# EAGLE design Tiny-G-ZA (EAGLE 6.4)
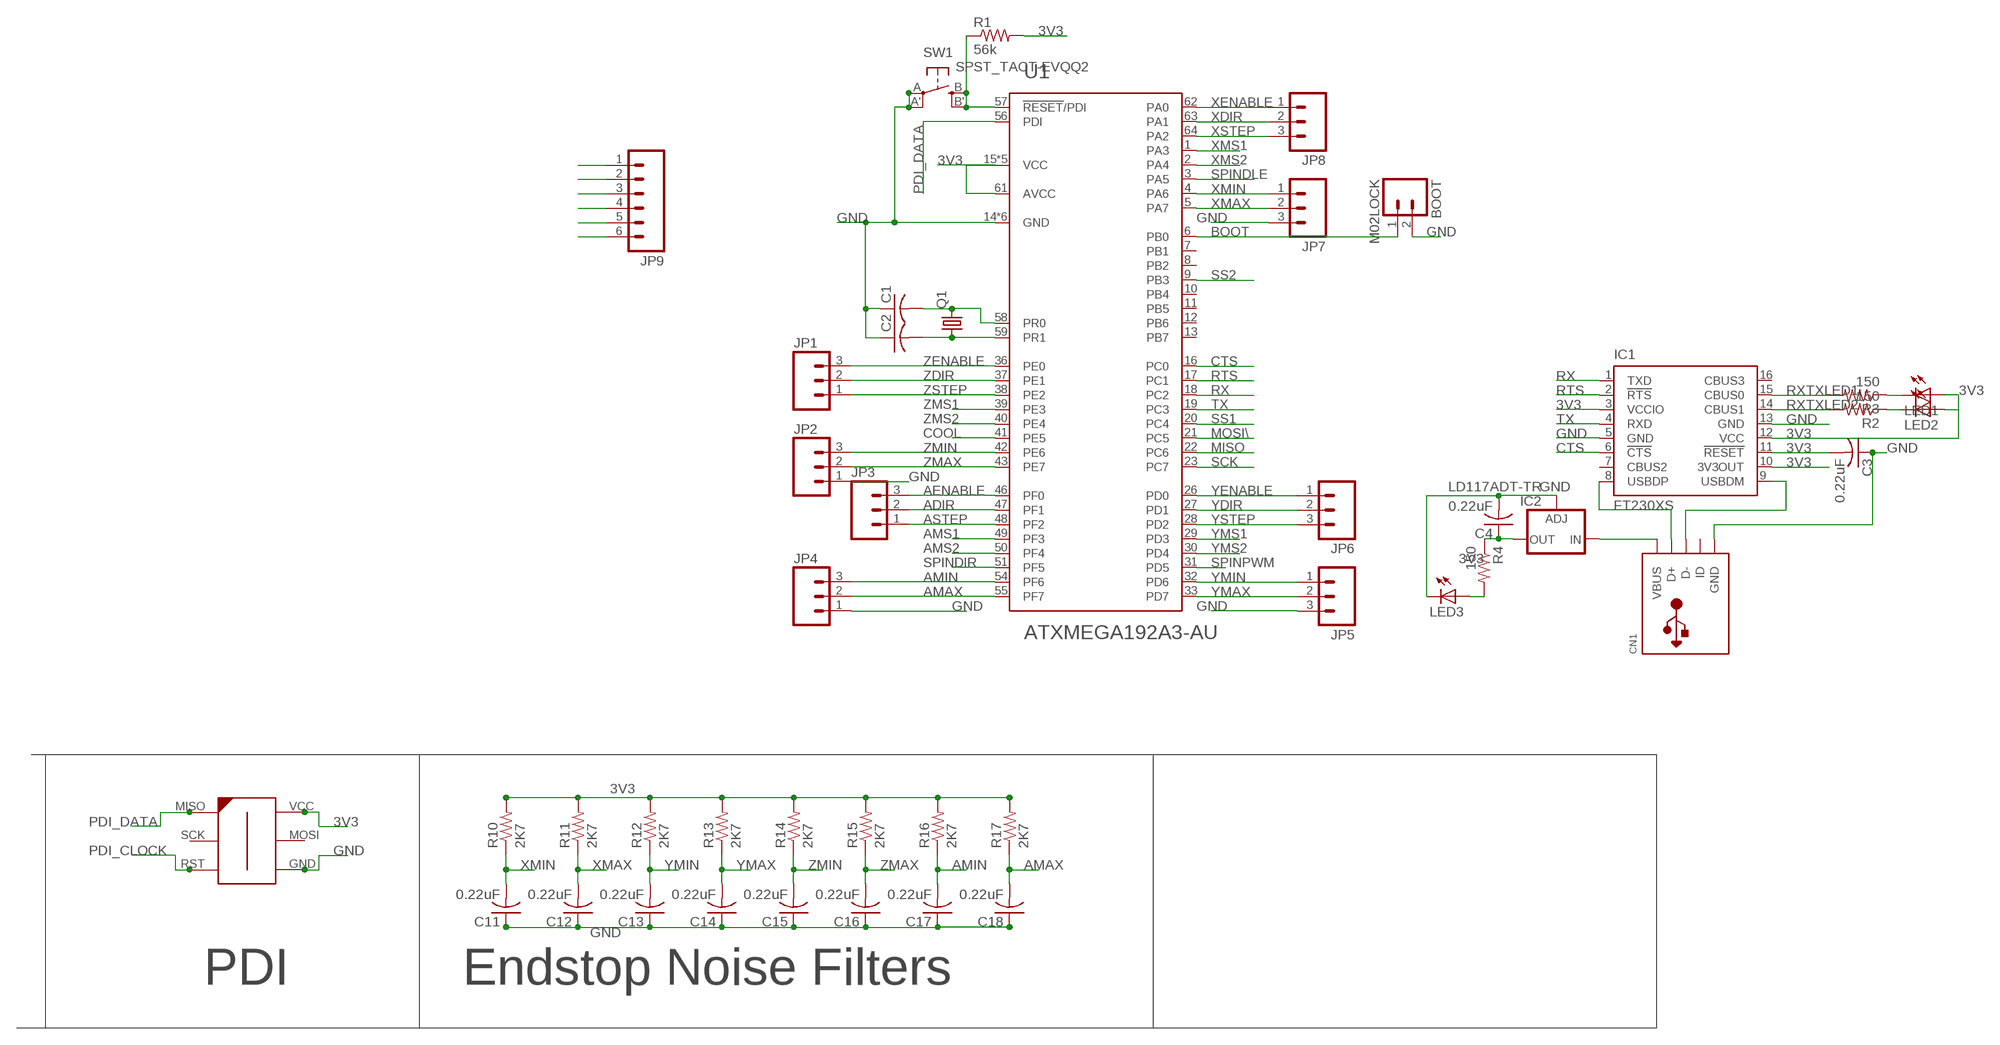
[diagram p0: schematic, sheet 1]

## Parts
BOOT  M02LOCK  [1X02_LOCK]
C1  C-USC1206K  [C1206K]
C2  C-USC1206K  [C1206K]
C3  0.22uF  C-USC1206K  [C1206K]
C4  0.22uF  C-USC1206K  [C1206K]
C11  0.22uF  C-USC1206K  [C1206K]
C12  0.22uF  C-USC1206K  [C1206K]
C13  0.22uF  C-USC1206K  [C1206K]
C14  0.22uF  C-USC1206K  [C1206K]
C15  0.22uF  C-USC1206K  [C1206K]
C16  0.22uF  C-USC1206K  [C1206K]
C17  0.22uF  C-USC1206K  [C1206K]
C18  0.22uF  C-USC1206K  [C1206K]
CN1  USBMINIB  [USB-MINIB]
IC1  FT230XS  [SSOP16]
IC2  LD117ADT-TR  [DPACK]
JP1  M03LONGPADS  [1X03_LONGPADS]
JP2  M03LONGPADS  [1X03_LONGPADS]
JP3  M03LONGPADS  [1X03_LONGPADS]
JP4  M03LONGPADS  [1X03_LONGPADS]
JP5  M03LONGPADS  [1X03_LONGPADS]
JP6  M03LONGPADS  [1X03_LONGPADS]
JP7  M03LONGPADS  [1X03_LONGPADS]
JP8  M03LONGPADS  [1X03_LONGPADS]
JP9  M06LONGPADS  [1X06_LONGPADS]
LED1  LEDSMT1206  [1206]
LED2  LEDSMT1206  [1206]
LED3  LEDSMT1206  [1206]
Q1  CRYSTALHC49UP  [HC49UP]
R1  56k  R-US_M1206  [M1206]
R2  150  R-US_M1206  [M1206]
R3  150  R-US_M1206  [M1206]
R4  150  R-US_M1206  [M1206]
R10  2K7  R-US_M1206  [M1206]
R11  2K7  R-US_M1206  [M1206]
R12  2K7  R-US_M1206  [M1206]
R13  2K7  R-US_M1206  [M1206]
R14  2K7  R-US_M1206  [M1206]
R15  2K7  R-US_M1206  [M1206]
R16  2K7  R-US_M1206  [M1206]
R17  2K7  R-US_M1206  [M1206]
SW1  SPST_TACT-EVQQ2  [EVQ-Q2]
U1  ATXMEGA192A3-AU  [TQFP-64A-64]
U$1  AVR-ISP-6-EDGE  [6PAD_ISP]

## Nets
3V3: C3.2 C4.1 IC1.3(VCCIO) IC1.10(3V3OUT) IC1.11(!RESET) IC1.12(VCC) IC2.4(OUT) JP9.1 LED1.A LED2.A R1.2 R4.1 R10.2 R11.2 R12.2 R13.2 R14.2 R15.2 R16.2 R17.2 U1.15(VCC) U1.25(VCC) U1.35(VCC) U1.45(VCC) U1.53(VCC) U1.61(AVCC) U$1.VCC
5V: CN1.VBUS IC2.3(IN)
ADIR: JP3.2 U1.47(PF1)
AENABLE: JP3.3 U1.46(PF0)
AMAX: C18.2 JP4.2 R17.1 U1.55(PF7)
AMIN: C17.2 JP4.3 R16.1 U1.54(PF6)
AMS1: U1.49(PF3)
AMS2: U1.50(PF4)
ASTEP: JP3.1 U1.48(PF2)
BOOT: BOOT.1 U1.6(PB0)
COOL: JP9.6 U1.41(PE5)
CTS: IC1.6(!CTS) U1.16(PC0)
GND: BOOT.2 C1.1 C2.1 C3.1 C4.2 C11.1 C12.1 C13.1 C14.1 C15.1 C16.1 C17.1 C18.1 CN1.GND IC1.5(GND) IC1.13(GND) IC2.1(ADJ) JP2.1 JP4.1 JP5.3 JP7.3 JP9.2 LED3.C SW1.A'(P1) SW1.A(P) U1.14(GND) U1.24(GND) U1.34(GND) U1.44(GND) U1.52(GND) U1.60(GND) U$1.GND
MISO: U1.22(PC6)
MOSI\: U1.21(PC5)
N$1: CN1.D+ IC1.8(USBDP)
N$2: CN1.D- IC1.9(USBDM)
N$3: LED3.A R4.2
N$4: LED2.C R2.1
N$5: LED1.C R3.1
PDI_CLOCK: R1.1 SW1.B'(S1) SW1.B(S) U1.57(!RESET!/PDI) U$1.RST
PDI_DATA: U1.56(PDI) U$1.MISO
PR0: C1.2 Q1.2 U1.58(PR0)
PR1: C2.2 Q1.1 U1.59(PR1)
RTS: IC1.2(!RTS) U1.17(PC1)
RX: IC1.1(TXD) U1.18(PC2)
RXTXLED1: IC1.15(CBUS0) R3.2
RXTXLED2: IC1.14(CBUS1) R2.2
SCK: U1.23(PC7)
SPINDIR: JP9.5 U1.51(PF5)
SPINDLE: JP9.3 U1.3(PA5)
SPINPWM: JP9.4 U1.31(PD5)
SS1: U1.20(PC4)
SS2: U1.9(PB3)
TX: IC1.4(RXD) U1.19(PC3)
XDIR: JP8.2 U1.63(PA1)
XENABLE: JP8.1 U1.62(PA0)
XMAX: C12.2 JP7.2 R11.1 U1.5(PA7)
XMIN: C11.2 JP7.1 R10.1 U1.4(PA6)
XMS1: U1.1(PA3)
XMS2: U1.2(PA4)
XSTEP: JP8.3 U1.64(PA2)
YDIR: JP6.2 U1.27(PD1)
YENABLE: JP6.1 U1.26(PD0)
YMAX: C14.2 JP5.2 R13.1 U1.33(PD7)
YMIN: C13.2 JP5.1 R12.1 U1.32(PD6)
YMS1: U1.29(PD3)
YMS2: U1.30(PD4)
YSTEP: JP6.3 U1.28(PD2)
ZDIR: JP1.2 U1.37(PE1)
ZENABLE: JP1.3 U1.36(PE0)
ZMAX: C16.2 JP2.2 R15.1 U1.43(PE7)
ZMIN: C15.2 JP2.3 R14.1 U1.42(PE6)
ZMS1: U1.39(PE3)
ZMS2: U1.40(PE4)
ZSTEP: JP1.1 U1.38(PE2)
Unconnected: CN1.ID IC1.7(CBUS2) IC1.16(CBUS3) U1.7(PB1) U1.8(PB2) U1.10(PB4) U1.11(PB5) U1.12(PB6) U1.13(PB7) U$1.MOSI U$1.SCK

## Notes on the sheet
- PDI | Endstop Noise Filters

## Library data of the parts
BOOT = SparkFun-Connectors:M02: Standard 2-pin 0.1" header. Use with - straight break away headers ( PRT-00116) - right angle break away headers (PRT-00553) - swiss pins (PRT-00743) - machine pins (PRT-00117) - female headers (PRT-00115) Molex polarized connector foot print use with: PRT-08233 with associated crimp pins and housings. 2.54_SCREWTERM for use with PRT-10571. 3.5mm Screw Terminal footprints for PRT-08084 5mm Screw Terminal footprints for use with PRT-08432
C1-C4 C11-C18 = adafruit:C-US: CAPACITOR, American symbol
CN1 = adafruit:USB: USB Connectors USBMINIB - Surface Mount Female Mini-B USB Connector 4UConnector: 06564 By microbuilder.eu Thru-hole RA Female Mini-B USB Connector 4UConnector: 18732 By ladyada.net
IC1 = ftdichip:FT230X: USB to BASIC UART IC Auto generated by make-symbol-device-package-bsdl.ulp Rev. 43 Source: Data sheet <http://www.ftdichip.com/Support/Documents/DataSheets/ICs/DS_FT230X.pdf>
IC2 = v-reg:LD117A?*: Low drop fixed and adjustable positive voltage regulators 1 A Source: http://www.st.com/stonline/products/literature/ds/7194/ld1117axx.pdf
JP1-JP8 = SparkFun-Connectors:M03: Header 3 Standard 3-pin 0.1" header. Use with straight break away headers (SKU : PRT-00116), right angle break away headers (PRT-00553), swiss pins (PRT-00743), machine pins (PRT-00117), and female headers (PRT-00115). Molex polarized connector foot print use with SKU : PRT-08232 with associated crimp pins and housings.
JP9 = SparkFun-Connectors:M06: Header 6 Standard 6-pin 0.1" header. Use with straight break away headers (SKU : PRT-00116), right angle break away headers (PRT-00553), swiss pins (PRT-00743), machine pins (PRT-00117), and female headers (PRT-00115). Molex polarized connector foot print use with SKU : PRT-08094 with associated crimp pins and housings. NOTES ON THE VARIANTS LOCK and LOCK_LONGPADS... This footprint was designed to help hold the alignment of a through-hole component (i.e. 6-pin header) while soldering it into place. You may notice that each hole has been shifted either up or down by 0.005 of an inch from it's more standard position (which is a perfectly straight line). This slight alteration caused the pins (the squares in the middle) to touch the edges of the holes. Because they are alternating, it causes a "brace" to hold the component in place. 0.005 has proven to be the perfect amount of "off-center" position when using our standard breakaway headers. Although looks a little odd when you look at the bare footprint, once you have a header in there, the alteration is very hard to notice. Also,if you push a header all the way into place, it is covered up entirely on the bottom side. This idea of altering the position of holes to aid alignment will be further integrated into the Sparkfun Library for other footprints. It can help hold any component with 3 or more connection pins.
LED1-LED3 = led:LED: LED OSRAM: - CHIPLED LG R971, LG N971, LY N971, LG Q971, LY Q971, LO R971, LY R971 LH N974, LH R974 LS Q976, LO Q976, LY Q976 LO Q996 - Hyper CHIPLED LW Q18S LB Q993, LB Q99A, LB R99A - SideLED LS A670, LO A670, LY A670, LG A670, LP A670 LB A673, LV A673, LT A673, LW A673 LH A674 LY A675 LS A676, LA A676, LO A676, LY A676, LW A676 LS A679, LY A679, LG A679 - Hyper Micro SIDELED® LS Y876, LA Y876, LO Y876, LY Y876 LT Y87S - SmartLED LW L88C, LW L88S LB L89C, LB L89S, LG L890 LS L89K, LO L89K, LY L89K LS L896, LA L896, LO L896, LY L896 - TOPLED LS T670, LO T670, LY T670, LG T670, LP T670 LSG T670, LSP T670, LSY T670, LOP T670, LYG T670 LG T671, LOG T671, LSG T671 LB T673, LV T673, LT T673, LW T673 LH T674 LS T676, LA T676, LO T676, LY T676, LB T676, LH T676, LSB T676, LW T676 LB T67C, LV T67C, LT T67C, LS T67K, LO T67K, LY T67K, LW E67C LS E67B, LA E67B, LO E67B, LY E67B, LB E67C, LV E67C, LT E67C LW T67C LS T679, LY T679, LG T679 LS T770, LO T770, LY T770, LG T770, LP T770 LB T773, LV T773, LT T773, LW T773 LH T774 LS E675, LA E675, LY E675, LS T675 LS T776, LA T776, LO T776, LY T776, LB T776 LHGB T686 LT T68C, LB T68C - Hyper Mini TOPLED® LB M676 - Mini TOPLED Santana® LG M470 LS M47K, LO M47K, LY M47K Source: http://www.osram.convergy.de LUXEON: - LUMILED® LXK2-PW12-R00, LXK2-PW12-S00, LXK2-PW14-U00, LXK2-PW14-V00 LXK2-PM12-R00, LXK2-PM12-S00, LXK2-PM14-U00 LXK2-PE12-Q00, LXK2-PE12-R00, LXK2-PE12-S00, LXK2-PE14-T00, LXK2-PE14-U00 LXK2-PB12-K00, LXK2-PB12-L00, LXK2-PB12-M00, LXK2-PB14-N00, LXK2-PB14-P00, LXK2-PB14-Q00 LXK2-PR12-L00, LXK2-PR12-M00, LXK2-PR14-Q00, LXK2-PR14-R00 LXK2-PD12-Q00, LXK2-PD12-R00, LXK2-PD12-S00 LXK2-PH12-R00, LXK2-PH12-S00 LXK2-PL12-P00, LXK2-PL12-Q00, LXK2-PL12-R00 Source: www.luxeon.com KINGBRIGHT: KA-3528ASYC Source: www.kingbright.com
Q1 = crystal:CRYSTAL: CRYSTAL; OC_FARNELL: unknown; OC_NEWARK: unknown
R1-R4 R10-R17 = adafruit:R-US_: RESISTOR, American symbol
SW1 = adafruit:SPST_TACT: SMT 6mm switch, EVQQ2 series http://www.ladyada.net/library/eagle
U1 = atmega-atxmega:ATXMEGA192A3: 8/16-bit XMEGA A3 Microcontroller Features High-performance, Low-power 8/16-bit Atmel® AVR® XMEGATM Microcontroller Non-volatile Program and Data Memories – 64 KB - 256 KB of In-System Self-Programmable Flash – 4 KB - 8 KB Boot Code Section with Independent Lock Bits – 2 KB - 4 KB EEPROM – 4 KB - 16 KB Internal SRAM Peripheral Features – Four-channel DMA Controller with support for external requests – Eight-channel Event System – Seven 16-bit Timer/Counters Four Timer/Counters with 4 Output Compare or Input Capture channels Three Timer/Counters with 2 Output Compare or Input Capture channels High Resolution Extensions on all Timer/Counters Advanced Waveform Extension on one Timer/Counter – Seven USARTs IrDA Extension on 1 USART – AES and DES Crypto Engine – Two Two-wire Interfaces with dual address match (I2C and SMBus compatible) – Three SPI (Serial Peripheral Interfaces) – 16-bit Real Time Counter with Separate Oscillator – Two Eight-channel, 12-bit, 2 Msps Analog to Digital Converters – One Two-channel, 12-bit, 1 Msps Digital to Analog Converter – Four Analog Comparators with Window compare function – External Interrupts on all General Purpose I/O pins – Programmable Watchdog Timer with Separate On-chip Ultra Low Power Oscillator Special Microcontroller Features – Power-on Reset and Programmable Brown-out Detection – Internal and External Clock Options with PLL – Programmable Multi-level Interrupt Controller – Sleep Modes: Idle, Power-down, Standby, Power-save, Extended Standby – Advanced Programming, Test and Debugging Interfaces JTAG (IEEE 1149.1 Compliant) Interface for test, debug and programming PDI (Program and Debug Interface) for programming, test and debugging I/O and Packages – 50 Programmable I/O Lines – 64-lead TQFP – 64-pad QFN Operating Voltage – 1.6 – 3.6V Speed performance – 0 – 12 MHz @ 1.6 – 3.6V – 0 – 32 MHz @ 2.7 – 3.6V
U$1 = atmega-atxmega:AVR-ISP-6-EDGE: 6 pin edge connector for ISP with ATMEL MCUs. Developed by Craig Moates (craig at moates dot net). Library by David Blundell (blundar at gmail dot com). Often, even a 6 pin header is really inconvenient for board layout and/or production. This SMD-only header is our de-facto standard for using an edge connector for programming with the help of a 6pin/10pin to edge card adapter.

## Board
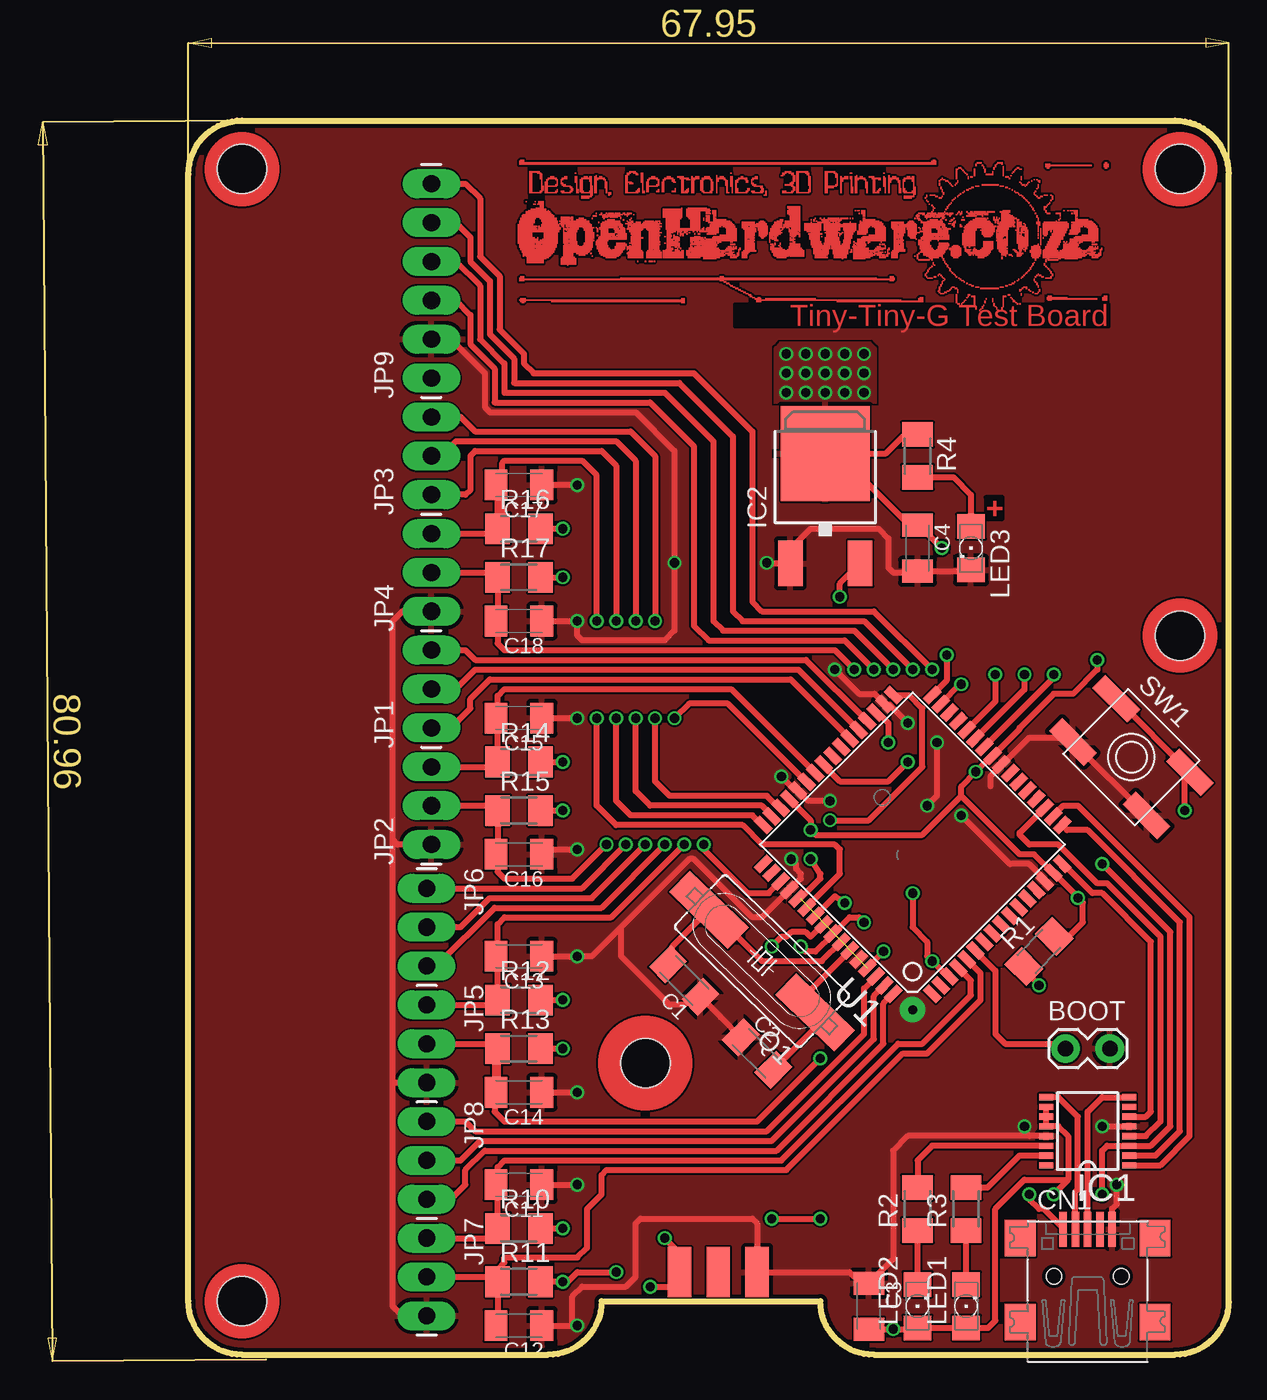
[diagram p1: board, top side]
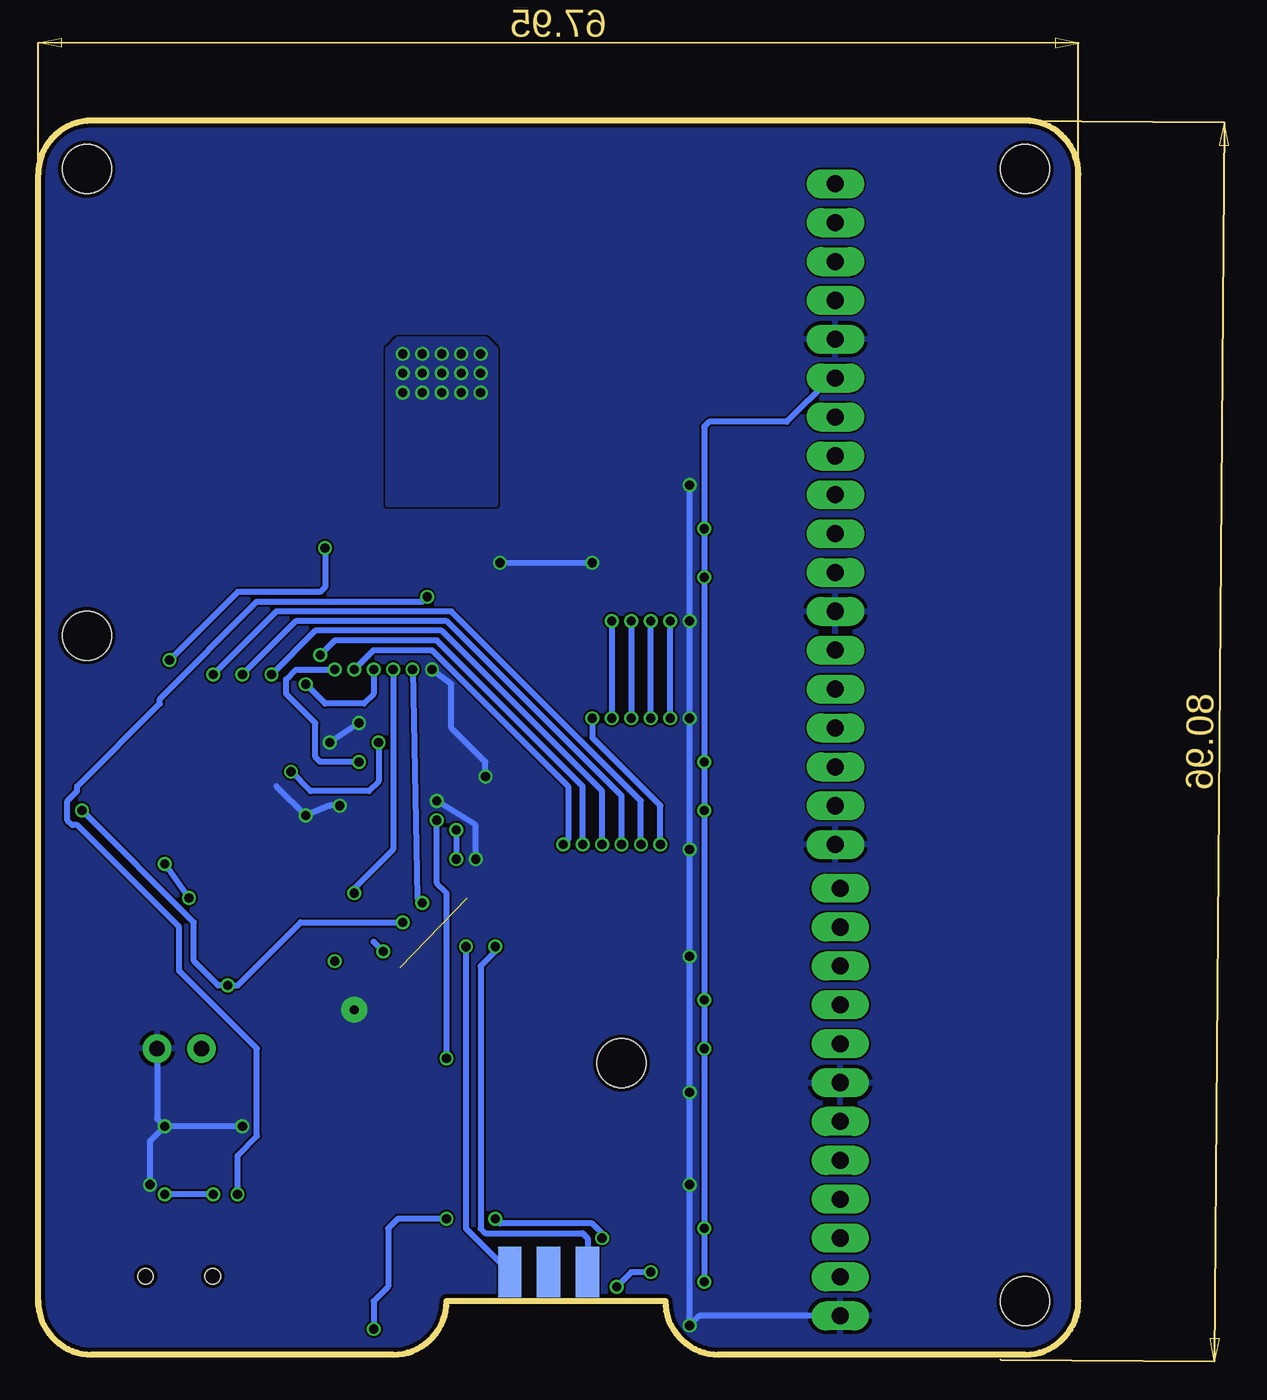
[diagram p2: board, bottom side, seen from below]

Size 67.94 x 80.65 mm. Coordinates in mm from the lower left corner, seen from the top.
Outline: 0,77.14 0,3.49 arc90 3.49,0 23.49,0 arc90 26.99,3.49 41.27,3.49 arc90 44.77,0 64.45,0 arc90 67.94,3.49
Outline: 0,77.15 arc-90 3.49,80.64
Outline: 3.17,80.64 64.44,80.64
Outline: 67.94,3.17 67.94,77.15 arc90 64.45,80.64
Copper layers (1*16): Top 0.035mm / dielectric 1.5mm / Bottom 0.035mm
Design rules "dirt_cheap_dirty_boards.v1": minimum track width 5mil, minimum drill 12mil, track to track 5mil, track to pad 5mil, pad to pad 5mil, via to via 5mil, smd to smd 0mil, copper to edge 10mil, drill to drill 10mil, minimum pad ring 10mil, minimum via ring 6mil, stop-mask expansion 2mil, vias tented up to drill 25mil, thermal gap 10mil
Holes 3.2 mm at 3.49,3.49 3.49,77.47 64.77,77.47 29.84,19.05 64.77,46.99

### Footprints (pad centres in the part's own frame; a part is rotated, then mirrored left to right if it is on the bottom)
1X02_LOCK = drill 1.016 pad 1.88: 1 -0.178,0; 2 2.718,0
C1206K = smd 1.5 x 2: 1 -1.5,0; 2 1.5,0
USB-MINIB = smd 0.5 x 2.308: D+ 0,4.064; D- -0.8,4.064; GND 1.6,4.064; ID 0.8,4.064; VBUS -1.6,4.064 | smd 2 x 2.4: GND1 -4.4,-2; GND2 -4.4,3.5; GND3 4.4,3.5; GND4 4.4,-2 | hole 1: -2.2,1; 2.2,1
SSOP16 = smd 0.914 x 0.406: 1 -2.718,2.223; 2 -2.718,1.587; 3 -2.718,0.953; 4 -2.718,0.318; 5 -2.718,-0.318; 6 -2.718,-0.953; 7 -2.718,-1.587; 8 -2.718,-2.223; 9 2.718,-2.223; 10 2.718,-1.587; 11 2.718,-0.953; 12 2.718,-0.318; 13 2.718,0.318; 14 2.718,0.953; 15 2.718,1.587; 16 2.718,2.223
DPACK = smd 1.6 x 3: 1 -2.28,-4.8; 3 2.28,-4.8 | smd 5.8 x 6.2: 4 0,2.38
1X03_LONGPADS = drill 1.118 pad 1.88 long: 1 0,0; 2 2.54,0; 3 5.08,0
1X06_LONGPADS = drill 1.118 pad 1.88 long: 1 0,0; 2 2.54,0; 3 5.08,0; 4 7.62,0; 5 10.16,0; 6 12.7,0
1206 = smd 1.6 x 1.803: A -1.422,0; C 1.422,0
HC49UP = smd 5.334 x 1.93: 1 -4.826,0; 2 4.826,0
M1206 = smd 1.6 x 2: 1 -1.4,0; 2 1.4,0
EVQ-Q2 = smd 3.2 x 1.2: A -3.4,-2; A' 3.4,-2; B -3.4,2; B' 3.4,2
TQFP-64A-64 = smd 1.194 x 0.559: 1 -7.8,6; 2 -7.8,5.2; 3 -7.8,4.4; 4 -7.8,3.6; 5 -7.8,2.8; 6 -7.8,2; 7 -7.8,1.2; 8 -7.8,0.4; 9 -7.8,-0.4; 10 -7.8,-1.2; 11 -7.8,-2; 12 -7.8,-2.8; 13 -7.8,-3.6; 14 -7.8,-4.4; 15 -7.8,-5.2; 16 -7.8,-6; 33 7.8,-6; 34 7.8,-5.2; 35 7.8,-4.4; 36 7.8,-3.6; 37 7.8,-2.8; 38 7.8,-2; 39 7.8,-1.2; 40 7.8,-0.4; 41 7.8,0.4; 42 7.8,1.2; 43 7.8,2; 44 7.8,2.8; 45 7.8,3.6; 46 7.8,4.4; 47 7.8,5.2; 48 7.8,6 | smd 0.559 x 1.194: 17 -6,-7.8; 18 -5.2,-7.8; 19 -4.4,-7.8; 20 -3.6,-7.8; 21 -2.8,-7.8; 22 -2,-7.8; 23 -1.2,-7.8; 24 -0.4,-7.8; 25 0.4,-7.8; 26 1.2,-7.8; 27 2,-7.8; 28 2.8,-7.8; 29 3.6,-7.8; 30 4.4,-7.8; 31 5.2,-7.8; 32 6,-7.8; 49 6,7.8; 50 5.2,7.8; 51 4.4,7.8; 52 3.6,7.8; 53 2.8,7.8; 54 2,7.8; 55 1.2,7.8; 56 0.4,7.8; 57 -0.4,7.8; 58 -1.2,7.8; 59 -2,7.8; 60 -2.8,7.8; 61 -3.6,7.8; 62 -4.4,7.8; 63 -5.2,7.8; 64 -6,7.8
6PAD_ISP = smd 1.524 x 3.302 bottom: GND 2.54,0; MOSI 0,0; VCC -2.54,0 | smd 1.524 x 3.302: MISO -2.54,0; RST 2.54,0; SCK 0,0

### Placement (x,y rotation side)
BOOT  57.47,20 0 top
C1  32.38,24.45 135 top
C2  37.15,19.69 315 top
C3  44.45,3.17 270 top
C4  47.62,52.7 270 top
C11  21.59,11.11 180 top
C12  21.59,1.91 180 top
C13  21.59,26.03 180 top
C14  21.59,17.14 180 top
C15  21.59,41.59 180 top
C16  21.59,32.7 180 top
C17  21.59,56.83 180 top
C18  21.59,47.94 180 top
CN1  58.74,4.13 0 top
IC1  58.74,14.61 180 top
IC2  41.59,56.52 0 top
JP1  15.88,40.96 90 top
JP2  15.88,33.34 90 top
JP3  15.88,56.2 90 top
JP4  15.88,48.58 90 top
JP5  15.56,22.86 270 top
JP6  15.56,30.48 270 top
JP7  15.56,7.62 270 top
JP8  15.56,15.24 270 top
JP9  15.88,63.82 90 top
LED1  50.8,3.17 90 top
LED2  47.62,3.17 90 top
LED3  51.12,52.7 270 top
Q1  37.47,25.72 135.9 top
R1  55.56,26.35 45 top
R2  47.62,9.53 90 top
R3  50.8,9.53 90 top
R4  47.62,58.74 270 top
R10  21.59,8.25 0 top
R11  21.59,4.76 0 top
R12  21.59,23.18 0 top
R13  21.59,20 0 top
R14  21.59,38.73 0 top
R15  21.59,35.56 0 top
R16  21.59,53.98 0 top
R17  21.59,50.8 0 top
SW1  61.59,39.05 315 top
U1  47.31,33.34 135 top
U$1  34.61,5.4 180 bottom

### Tracks (layer width: path | path; a pad name or v marks a point on that pad's centre or on a via)
3V3  (via drill 0.6)  (1 unrouted)
  Top 0.406: R16.2 v24.45,53.97 | R11.2 v24.45,4.76 24.76,4.76 25.4,5.4 v27.94,5.4 | R10.2 v24.45,8.25 | R13.2 v24.45,20 | R12.2 v24.45,23.18 | R15.2 v24.45,35.56 | R14.2 v24.45,38.73 | R17.2 v24.45,50.8 | v30.16,4.44 32.07,4.44 U$1.VCC 32.07,6.67 v31.11,7.62 | C3.2 v46.04,1.67 47.55,1.67 LED2.A LED1.A 52.24,1.75 52.7,2.22 52.7,9.52 54.61,11.43 57.47,11.43 | IC1.10 IC1.11 IC1.12 56.83,14.92 57.47,14.29 57.47,11.43 | 57.47,11.43 v56.51,10.48 | v59.69,10.48 59.69,13.33 60.01,13.65 IC1.3 62.86,13.65 64.13,14.92 64.13,27.62 v59.69,32.07 | U1.61 v45.4,26.35 | U1.53 39.96,29.8 41.27,31.11 41.27,31.43 v40.64,32.38 | U1.45 39.26,36.31 40.64,34.92 v40.64,34.29 40.96,33.97 47.94,33.97 50.48,36.51 | 50.48,36.51 54.29,32.7 55.24,32.7 56.45,31.5 U1.15 57.78,30.21 v58.1,29.84 58.42,29.53 58.42,28.26 57.5,27.34 R1.2 | 50.48,36.51 50.48,37.15 v51.43,38.1 52.47,39.14 U1.25 54.29,40.89 54.29,40.96 56.51,43.18 57.78,43.18 59.37,44.77 v59.37,45.4 | v38.1,8.89 v41.27,8.89 | U1.35 45.03,41.96 45.72,41.27 v45.72,40 | R4.1 47.49,60.01 46.67,60.01 45.56,58.89 IC2.4 43.34,57.15 44.13,57.15 47.08,54.2 C4.1 47.71,54.2 v49.21,52.7
  Bottom 0.406: v24.45,4.76 v24.45,8.25 v24.45,20 v24.45,23.18 v24.45,35.56 v24.45,38.73 v24.45,50.8 v24.45,53.97 24.45,60.64 24.13,60.96 19.05,60.96 16.19,63.82 JP9.1 | v27.94,5.4 29.21,5.4 v30.16,4.44 | v56.51,10.48 v59.69,10.48 | v45.4,26.35 46.04,26.99 | v59.69,32.07 v58.1,29.84 | v40.64,34.29 v40.64,32.38 | v31.11,7.62 31.11,7.94 31.75,8.57 37.78,8.57 v38.1,8.89 | v41.27,8.89 44.45,8.89 45.08,8.25 45.08,4.44 46.04,3.49 v46.04,1.67 | v45.72,40 45.72,37.46 46.35,36.83 50.16,36.83 v51.43,38.1 | v49.21,52.7 49.21,50.16 49.53,49.85 54.93,49.85 v59.37,45.4
  other vias: 39.05,65.41 40.32,65.41 41.59,65.41 42.86,65.41 44.13,65.41 39.05,64.14 40.32,64.14 41.59,64.14 42.86,64.14 44.13,64.14 39.05,62.86 40.32,62.86 41.59,62.86 42.86,62.86 44.13,62.86
  pour Bottom: 38.1,55.56 45.09,55.56 45.09,65.72 44.45,66.36 38.74,66.36 38.1,65.72
  pour Top: 38.74,55.88 38.42,56.2 38.42,65.72 38.74,66.04 44.45,66.04 44.77,65.72 44.77,55.88
5V  (via drill 0.6)
  Top 0.406: CN1.VBUS 57.14,8.27 55.88,9.52 55.56,9.52 54.93,10.16 v54.93,10.48 | v42.54,49.53 42.54,50.39 IC2.3
  Bottom 0.406: v54.93,10.48 54.93,13.02 53.66,14.29 53.66,20 58.74,25.08 58.74,27.94 65.4,34.61 65.72,34.61 66.04,34.92 66.04,36.19 65.4,36.83 65.4,37.15 60.01,42.54 60.01,42.86 53.66,49.21 42.86,49.21 v42.54,49.53
ADIR  (via drill 0.6)
  Top 0.406: JP3.2 16.51,58.74 17.46,59.69 27.94,59.69 29.21,58.42 v29.21,47.94 | U1.47 38.11,35.23 37.46,35.88 30.16,35.88 29.21,36.83 v29.21,41.59
  Bottom 0.406: v29.21,47.94 v29.21,41.59
AENABLE  (via drill 0.6)
  Top 0.406: JP3.3 17.78,61.28 18.73,60.32 28.89,60.32 30.48,58.74 v30.48,47.94 | U1.46 38.55,35.74 37.78,36.51 31.43,36.51 30.48,37.46 v30.48,41.59
  Bottom 0.406: v30.48,47.94 v30.48,41.59
AMAX  (via drill 0.6)
  Top 0.406: JP4.2 20.51,51.12 R17.1 20.19,48.04 | 20.19,48.04 C18.2 | 20.19,48.04 20.19,46.48 20.64,46.04 42.23,46.04 v43.5,44.77 | v42.86,29.53 42.23,29.95 U1.55
  Bottom 0.406: v43.5,44.77 43.18,29.84 v42.86,29.53
AMIN  (via drill 0.6)
  Top 0.406: JP4.3 20.51,53.66 | 20.51,53.66 R16.1 20.19,56.73 C17.2 | 20.51,53.66 20.51,58.29 20.64,58.42 25.72,58.42 26.67,57.47 v26.67,47.94 | U1.54 40.38,29.27 42.54,31.43 42.54,33.02 42.23,33.34 37.46,33.34 36.19,34.61 27.94,34.61 26.67,35.88 v26.67,41.59
  Bottom 0.406: v26.67,41.59 v26.67,47.94
ASTEP  (via drill 0.6)
  Top 0.406: JP3.1 18.1,56.2 18.41,56.51 18.41,58.74 18.73,59.05 26.99,59.05 27.94,58.1 v27.94,47.94 | U1.48 37.46,34.61 36.83,35.24 28.89,35.24 27.94,36.19 v27.94,41.59
  Bottom 0.406: v27.94,41.59 v27.94,47.94
BOOT
  Top 0.406: U1.6 51.41,26.38 52.7,25.08 52.7,20.95 53.34,20.32 56.97,20.32 BOOT.1
COOL  (via drill 0.6)
  Top 0.406: JP9.6 18.1,76.52 19.05,75.56 19.05,71.75 20.32,70.48 20.32,66.99 21.91,65.4 21.91,64.77 22.54,64.13 33.02,64.13 36.83,60.32 36.83,49.21 37.46,48.58 44.77,48.58 v48.58,44.77 | U1.41 41.51,38.5 42.54,37.46 45.72,37.46 v46.99,38.73
  Bottom 0.406: v46.99,38.73 49.53,38.73 49.85,39.05 49.85,41.27 51.75,43.18 51.75,44.13 51.12,44.77 v48.58,44.77
CTS
  Top 0.406: IC1.6 62.55,15.56 62.86,15.87 62.86,26.99 59.69,30.16 59.05,30.16 57.47,31.75 U1.16
GND  (via drill 0.6, 0.6 pad 1.68)
  Top 0.406: 13.33,17.78 13.33,3.17 13.97,2.54 JP7.3 | 13.33,17.78 13.33,33.65 | 13.33,33.65 13.33,47.94 13.97,48.58 JP4.1 | JP2.1 13.65,33.34 13.33,33.65 | JP5.3 13.33,17.78 | C12.1 25.08,1.9 | v25.4,56.83 C17.1 | C11.1 v25.4,11.11 | C14.1 v25.4,17.14 | C13.1 v25.4,26.03 26.35,26.03 28.26,27.94 | C16.1 23.18,32.7 23.49,33.02 v25.4,33.02 | C15.1 v25.4,41.59 | C18.1 v25.4,47.94 25.4,46.99 25.72,46.67 31.11,46.67 31.75,47.31 v31.75,51.75 31.75,59.05 29.21,61.59 19.68,61.59 19.37,61.91 19.37,64.13 17.14,66.36 JP9.2 | v25.4,1.9 25.08,1.9 | 25.08,1.9 25.08,3.81 25.72,4.44 28.57,4.44 29.21,5.08 29.21,8.57 29.53,8.89 36.83,8.89 37.15,8.57 U$1.GND 43.18,5.4 43.81,4.76 44.36,4.76 C3.1 46.04,6.26 46.04,13.33 46.99,14.29 IC1.13 54.93,14.29 54.61,14.6 v54.61,14.92 | C1.1 34.77,22.07 | 34.77,22.07 C2.1 | CN1.GND 60.34,9.54 60.64,9.84 v60.64,11.11 | v59.69,14.92 IC1.5 | 28.26,27.94 32.7,32.38 33.02,32.38 36.83,28.57 37.46,28.57 39.25,30.36 U1.52 39.26,30.37 40,31.11 40,31.43 39.69,31.75 39.69,32.07 v39.37,32.38 | 52.39,37.15 52.39,37.78 53.11,38.5 U1.24 53.17,38.57 54.93,40.32 57.5,40.32 SW1.A SW1.A' | U1.14 55.93,31.06 54.93,32.07 53.66,32.07 v50.48,35.24 | v41.91,36.19 40.49,36.19 U1.44 39.64,36.87 v38.73,37.78 | v42.23,44.77 43.81,43.18 44.82,43.18 U1.34 45.47,42.48 45.79,42.48 v46.99,41.27 | v48.89,40 48.89,36.51 v48.26,35.88 | v37.78,51.75 37.82,51.71 IC2.1 39.31,52.65 40.64,53.97 45.08,53.97 45.72,53.34 45.72,51.43 46.04,51.12 47.54,51.12 C4.2 51.04,51.2 LED3.C | 34.77,22.07 | 34.77,22.07 33.65,23.18 32.7,23.18 32.38,22.86 31.43,22.86 28.26,26.03 28.26,27.94
  Bottom 0.406: v25.4,56.83 v25.4,47.94 v25.4,41.59 v25.4,33.02 v25.4,26.03 v25.4,17.14 v25.4,11.11 v25.4,1.9 24.76,2.54 JP7.3 | v60.64,11.11 60.64,13.97 v59.69,14.92 | v54.61,14.92 v59.69,14.92 | 52.39,37.15 v50.48,35.24 48.89,35.88 v48.26,35.88 | BOOT.2 60.19,15.42 v59.69,14.92 | v39.37,32.38 39.37,34.61 v41.91,36.19 | v38.73,37.78 38.73,38.73 40.96,40.96 40.96,43.81 v42.23,44.77 | v46.99,41.27 v48.89,40 | v37.78,51.75 v31.75,51.75
  other vias: 47.31,22.54
  pour Bottom (rank 6): -6.98,84.77 -5.72,86.04 71.75,86.04 71.75,-1.9 70.17,-3.49 -0.32,-3.49 -6.98,3.17
  pour Top (rank 6): -3.18,82.23 -1.91,83.5 68.9,83.5 69.53,82.87 69.53,-0.32 67.31,-2.54 -1.27,-2.54 -3.18,-0.63
N$1
  Top 0.406: CN1.D+ 58.74,15.87 59.69,16.83 IC1.8
N$2
  Top 0.406: CN1.D- 57.94,10.63 58.1,10.79 58.1,15.56 56.83,16.83 IC1.9
N$3
  Top 0.406: R4.2 49.98,57.34 51.12,56.2 LED3.A
N$4
  Top 0.406: LED2.C R2.1
N$5
  Top 0.406: LED1.C R3.1
PDI_CLOCK  (via drill 0.6)
  Top 0.406: v44.13,28.26 43.81,28.57 43.18,28.57 42.14,27.54 U1.57 42.07,27.47 40.96,26.35 40.32,26.35 v40,26.67 | R1.1 54.57,25.12 v55.56,24.13 | v65.09,35.56 65.09,37.74 SW1.B' SW1.B
  Bottom 0.406: v44.13,28.26 50.8,28.26 54.93,24.13 v55.56,24.13 56.2,24.13 57.78,25.72 57.78,28.26 v65.09,35.56 | v40,26.67 40,8.25 U$1.RST
PDI_DATA  (via drill 0.6)
  Top 0.406: U1.56 41.44,28.1 40.64,27.3 40.32,27.62 39.37,27.62 39.05,27.3 38.73,27.3 v38.1,26.67
  Bottom 0.406: v38.1,26.67 38.1,26.35 39.05,25.4 39.05,8.25 38.73,7.94 32.38,7.94 32.07,7.62 U$1.MISO
PR0
  Top 0.406: U1.58 41.38,25.72 37.46,25.72 34.11,29.08 Q1.2 31.64,26.72 C1.2
PR1
  Top 0.406: U1.59 43.21,26.38 40,23.18 40.11,23.18 Q1.1 40.93,21.35 C2.2
RTS
  Top 0.406: IC1.2 63.18,13.02 64.77,14.6 64.77,28.26 58.74,34.29 57.39,34.29 U1.17
RX
  Top 0.406: IC1.1 63.5,12.38 65.4,14.29 65.4,28.57 58.1,35.88 57.15,35.88 56.5,35.23 U1.18
RXTXLED1
  Top 0.406: R3.2 52.2,10.92 54.29,13.02 IC1.15
RXTXLED2
  Top 0.406: IC1.14 48.58,13.65 47.62,12.7 R2.2
SPINDIR  (via drill 0.6)
  Top 0.406: JP9.5 17.46,73.98 18.41,73.02 18.41,71.44 19.68,70.17 19.68,66.67 21.27,65.09 21.27,63.5 32.07,63.5 35.56,60.01 35.56,48.58 36.19,47.94 44.13,47.94 v47.31,44.77 | v33.65,33.34 33.65,33.02 36.51,30.16 37.91,30.16 U1.51
  Bottom 0.406: v47.31,44.77 46.04,46.04 42.23,46.04 33.34,37.15 33.34,33.65 v33.65,33.34
SPINDLE  (via drill 0.6)
  Top 0.406: JP9.3 17.46,68.9 18.41,67.94 18.41,66.04 20,64.45 20,62.23 30.16,62.23 33.02,59.37 33.02,47.62 33.97,46.67 42.86,46.67 v44.77,44.77 | U1.3 49.58,24.71 v48.58,25.72 48.26,26.03 48.26,26.99 47.31,27.94 v47.31,30.16
  Bottom 0.406: v44.77,44.77 44.77,33.02 47.31,30.48 v47.31,30.16
SPINPWM  (via drill 0.6)
  Top 0.406: JP9.4 17.46,71.44 19.05,69.85 19.05,66.36 20.64,64.77 20.64,62.86 31.11,62.86 34.29,59.69 34.29,47.94 34.92,47.31 43.5,47.31 v46.04,44.77 | v50.48,43.81 50.43,43.81 U1.31
  Bottom 0.406: v46.04,44.77 46.04,43.18 46.67,42.54 49.21,42.54 v50.48,43.81
TX
  Top 0.406: IC1.4 62.55,14.29 63.5,15.24 63.5,27.3 60.01,30.8 59.37,30.8 56.83,33.34 54.93,33.34 54.29,33.97 54.29,34.1 U1.19
XDIR
  Top 0.406: JP8.2 17.78,12.7 19.05,13.97 38.1,13.97 44.77,20.64 44.77,23.44 U1.63
XENABLE
  Top 0.406: JP8.1 18.1,15.24 18.73,14.6 37.78,14.6 44.13,20.95 44.13,23.94 U1.62
XMAX
  Top 0.406: JP7.2 19.87,5.08 R11.1 | R11.1 20.19,2 C12.2 | R11.1 20.19,5.58 20.64,6.03 20.64,6.35 25.4,6.35 26.03,6.98 26.03,9.52 26.99,10.48 26.99,11.75 27.3,12.06 39.05,12.06 46.67,19.68 48.26,19.68 51.75,23.18 51.75,24.93 U1.5
XMIN
  Top 0.406: JP7.1 19.87,7.62 R10.1 20.19,10.69 | 20.19,10.69 C11.2 | 20.19,10.69 20.19,12.25 20.64,12.7 38.73,12.7 46.35,20.32 47.94,20.32 51.12,23.49 51.12,24.45 51.11,24.45 U1.4
XSTEP
  Top 0.406: JP8.3 17.14,10.16 18.1,11.11 18.1,12.06 19.37,13.33 38.42,13.33 45.4,20.32 45.4,22.95 U1.64
YDIR  (via drill 0.6)
  Top 0.406: JP6.2 17.78,27.94 19.68,29.84 26.35,29.84 v29.84,33.34 | v54.61,44.45 54.61,43.47 U1.27
  Bottom 0.406: v29.84,33.34 29.84,36.51 41.27,47.94 51.12,47.94 v54.61,44.45
YENABLE  (via drill 0.6)
  Top 0.406: JP6.1 25.72,30.48 v28.57,33.34 | v56.51,44.45 56.51,44.24 U1.26
  Bottom 0.406: v28.57,33.34 28.57,36.19 40.96,48.58 52.39,48.58 v56.51,44.45
YMAX  (via drill 0.6)
  Top 0.406: JP5.2 19.87,20.32 | 19.87,20.32 R13.1 20.19,17.24 C14.2 | 19.87,20.32 20,20.32 20,15.87 20.64,15.24 37.15,15.24 v41.27,19.37 | v41.91,34.92 44.45,34.92 47.94,38.42 47.94,42.23 47.07,43.1 U1.33
  Bottom 0.406: v41.27,19.37 41.27,30.16 41.91,30.8 v41.91,34.92
YMIN  (via drill 0.6)
  Top 0.406: JP5.1 19.87,22.86 R12.1 20.19,25.93 | 20.19,25.93 C13.2 | 20.19,25.93 20.19,28.13 20.64,28.57 27.62,28.57 v32.38,33.34 | v49.53,45.72 49.53,44.05 U1.32
  Bottom 0.406: v32.38,33.34 32.38,37.15 41.91,46.67 48.58,46.67 v49.53,45.72
YSTEP  (via drill 0.6)
  Top 0.406: JP6.3 16.19,25.4 20,29.21 26.99,29.21 v31.11,33.34 | v52.7,44.45 52.7,42.69 U1.28
  Bottom 0.406: v31.11,33.34 31.11,36.83 41.59,47.31 49.85,47.31 v52.7,44.45
ZDIR
  Top 0.406: JP1.2 17.46,43.5 18.73,44.77 39.84,44.77 U1.37
ZENABLE
  Top 0.406: JP1.3 18.1,46.04 18.73,45.4 40.33,45.4 U1.36
ZMAX  (via drill 0.6)
  Top 0.406: JP2.2 19.87,35.88 R15.1 | R15.1 20.19,32.8 C16.2 | R15.1 20.19,31.56 20.64,31.11 25.08,31.11 v27.3,33.34 | U1.43 40.35,37.44 35.24,42.54 32.7,42.54 v31.75,41.59
  Bottom 0.406: v27.3,33.34 27.3,35.88 31.75,40.32 v31.75,41.59
ZMIN
  Top 0.406: JP2.3 19.87,38.42 R14.1 | R14.1 20.19,41.49 C15.2 | R14.1 20.19,43.05 20.64,43.5 35.45,43.5 U1.42
ZSTEP
  Top 0.406: JP1.1 17.14,40.96 18.41,42.23 18.41,42.86 19.68,44.13 39.34,44.13 U1.38
(copper drawn outside any net)
  shapes: Top area x2223, Top circle x17

### Text on the board
Top: Tiny-Tiny-G Test Board | +
tStop: Tiny-Tiny-G Test Board | +
ophwsilk: COOL | SPINDIR | SPINPWM | SPINDLE | GND | 3.3V | AENABLE | ADIR | 0.22u | 150R | 150R | ASTEP | 2K7 | AMIN | AMAX | 2K7 | GND | 0.22u | PWR | ZENABLE | 0.22u | ZDIR | 0.22u | ZSTEP | 2K7 | ZMIN | ZMAX | 2K7 | GND | 0.22u | YENABLE | YDIR | 56K | 0.22u | YSTEP | YMIN | 2K7 | YMAX | 2K7 | GND | 0.22u | XENABLE | XDIR | 0.22u | XSTEP | 2K7 | 150R | 150R | XMIN | XMAX | 2K7 | GND | 0.22u | 0.22u